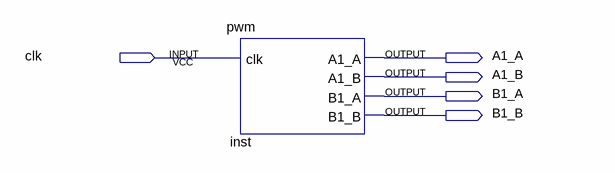
[diagram p0: schematic sheet]
// Quartus schematic motor.bdf as structural Verilog: 1 symbols, 5 pins
module motor (
  input  clk,
  output A1_A,
  output A1_B,
  output B1_A,
  output B1_B
);

  pwm inst (.clk(clk), .A1_A(A1_A), .A1_B(A1_B), .B1_A(B1_A), .B1_B(B1_B));
endmodule
